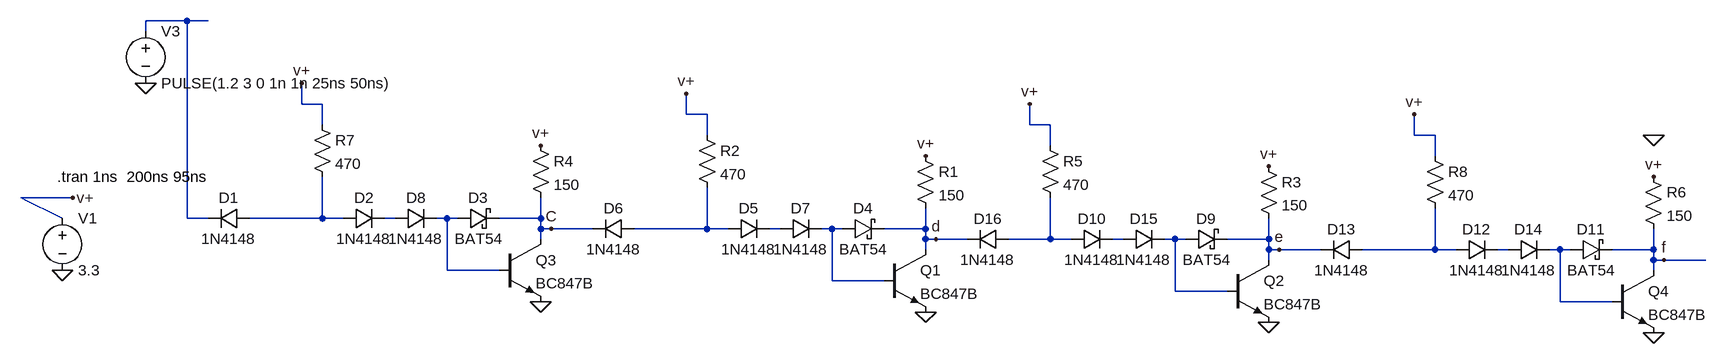
[diagram p0: schematic NandBakerClamp.asc]
NandBakerClamp.asc, the LTspice schematic file:
Version 4
SHEET 1 2532 952
WIRE -176 144 -240 144
WIRE -144 144 -176 144
WIRE -240 160 -240 144
WIRE 0 272 0 240
WIRE 32 272 0 272
WIRE 592 288 592 256
WIRE 624 288 592 288
WIRE 32 304 32 272
WIRE 1120 304 1120 272
WIRE 1152 304 1120 304
WIRE 624 320 624 288
WIRE 1712 320 1712 288
WIRE 1744 320 1712 320
WIRE 1152 336 1152 304
WIRE 1744 352 1744 320
WIRE -352 416 -432 416
WIRE -368 448 -432 416
WIRE -176 448 -176 144
WIRE -144 448 -176 448
WIRE 32 448 32 384
WIRE 32 448 -80 448
WIRE 64 448 32 448
WIRE 144 448 128 448
WIRE 224 448 208 448
WIRE 240 448 224 448
WIRE 368 448 368 416
WIRE 368 448 304 448
WIRE 368 464 368 448
WIRE 384 464 368 464
WIRE 448 464 384 464
WIRE 624 464 624 400
WIRE 624 464 512 464
WIRE 656 464 624 464
WIRE 736 464 720 464
WIRE 816 464 800 464
WIRE 832 464 816 464
WIRE 960 464 960 432
WIRE 960 464 896 464
WIRE 368 480 368 464
WIRE 960 480 960 464
WIRE 976 480 960 480
WIRE 1024 480 976 480
WIRE 1152 480 1152 416
WIRE 1152 480 1088 480
WIRE 1184 480 1152 480
WIRE 1264 480 1248 480
WIRE 1344 480 1328 480
WIRE 1360 480 1344 480
WIRE 1488 480 1488 448
WIRE 1488 480 1424 480
WIRE 960 496 960 480
WIRE 1488 496 1488 480
WIRE 1504 496 1488 496
WIRE 1568 496 1504 496
WIRE 1744 496 1744 432
WIRE 1744 496 1632 496
WIRE 1776 496 1744 496
WIRE 1856 496 1840 496
WIRE 1936 496 1920 496
WIRE 1952 496 1936 496
WIRE 2080 496 2080 464
WIRE 2080 496 2016 496
WIRE 1488 512 1488 496
WIRE 2080 512 2080 496
WIRE 2096 512 2080 512
WIRE 2160 512 2096 512
WIRE 224 528 224 448
WIRE 304 528 224 528
WIRE 2080 528 2080 512
WIRE 816 544 816 464
WIRE 896 544 816 544
WIRE 1344 560 1344 480
WIRE 1424 560 1344 560
WIRE 1936 576 1936 496
WIRE 2016 576 1936 576
FLAG -368 528 0
FLAG -352 416 v+
FLAG 368 576 0
FLAG 368 336 v+
FLAG 384 464 C
FLAG 0 240 v+
FLAG 960 592 0
FLAG 960 352 v+
FLAG 976 480 d
FLAG 592 256 v+
FLAG 1488 608 0
FLAG 1488 368 v+
FLAG 1504 496 e
FLAG 1120 272 v+
FLAG 2080 624 0
FLAG 2080 384 v+
FLAG 2096 512 f
FLAG 1712 288 v+
FLAG -240 240 0
FLAG 2080 320 0
SYMBOL voltage -368 432 R0
SYMATTR InstName V1
SYMATTR Value 3.3
SYMBOL npn 304 480 R0
SYMATTR InstName Q3
SYMATTR Value BC847B
SYMBOL res 352 320 R0
SYMATTR InstName R4
SYMATTR Value 150
SYMBOL res 16 288 R0
SYMATTR InstName R7
SYMATTR Value 470
SYMBOL schottky 240 464 R270
WINDOW 0 32 32 VTop 2
WINDOW 3 0 32 VBottom 2
SYMATTR InstName D3
SYMATTR Value BAT54
SYMATTR Description Diode
SYMATTR Type diode
SYMBOL diode -80 432 R90
WINDOW 0 0 32 VBottom 2
WINDOW 3 32 32 VTop 2
SYMATTR InstName D1
SYMATTR Value 1N4148
SYMBOL diode 64 432 M90
WINDOW 0 0 32 VBottom 2
WINDOW 3 32 32 VTop 2
SYMATTR InstName D2
SYMATTR Value 1N4148
SYMBOL npn 896 496 R0
SYMATTR InstName Q1
SYMATTR Value BC847B
SYMBOL res 944 336 R0
SYMATTR InstName R1
SYMATTR Value 150
SYMBOL res 608 304 R0
SYMATTR InstName R2
SYMATTR Value 470
SYMBOL schottky 832 480 R270
WINDOW 0 32 32 VTop 2
WINDOW 3 0 32 VBottom 2
SYMATTR InstName D4
SYMATTR Value BAT54
SYMATTR Description Diode
SYMATTR Type diode
SYMBOL diode 656 448 M90
WINDOW 0 0 32 VBottom 2
WINDOW 3 32 32 VTop 2
SYMATTR InstName D5
SYMATTR Value 1N4148
SYMBOL diode 512 480 M270
WINDOW 0 32 32 VTop 2
WINDOW 3 0 32 VBottom 2
SYMATTR InstName D6
SYMATTR Value 1N4148
SYMBOL diode 736 448 M90
WINDOW 0 0 32 VBottom 2
WINDOW 3 32 32 VTop 2
SYMATTR InstName D7
SYMATTR Value 1N4148
SYMBOL diode 144 432 M90
WINDOW 0 0 32 VBottom 2
WINDOW 3 32 32 VTop 2
SYMATTR InstName D8
SYMATTR Value 1N4148
SYMBOL npn 1424 512 R0
SYMATTR InstName Q2
SYMATTR Value BC847B
SYMBOL res 1472 352 R0
SYMATTR InstName R3
SYMATTR Value 150
SYMBOL res 1136 320 R0
SYMATTR InstName R5
SYMATTR Value 470
SYMBOL schottky 1360 496 R270
WINDOW 0 32 32 VTop 2
WINDOW 3 0 32 VBottom 2
SYMATTR InstName D9
SYMATTR Value BAT54
SYMATTR Description Diode
SYMATTR Type diode
SYMBOL diode 1184 464 M90
WINDOW 0 0 32 VBottom 2
WINDOW 3 32 32 VTop 2
SYMATTR InstName D10
SYMATTR Value 1N4148
SYMBOL npn 2016 528 R0
SYMATTR InstName Q4
SYMATTR Value BC847B
SYMBOL res 2064 368 R0
SYMATTR InstName R6
SYMATTR Value 150
SYMBOL res 1728 336 R0
SYMATTR InstName R8
SYMATTR Value 470
SYMBOL schottky 1952 512 R270
WINDOW 0 32 32 VTop 2
WINDOW 3 0 32 VBottom 2
SYMATTR InstName D11
SYMATTR Value BAT54
SYMATTR Description Diode
SYMATTR Type diode
SYMBOL diode 1776 480 M90
WINDOW 0 0 32 VBottom 2
WINDOW 3 32 32 VTop 2
SYMATTR InstName D12
SYMATTR Value 1N4148
SYMBOL diode 1632 512 M270
WINDOW 0 32 32 VTop 2
WINDOW 3 0 32 VBottom 2
SYMATTR InstName D13
SYMATTR Value 1N4148
SYMBOL diode 1856 480 M90
WINDOW 0 0 32 VBottom 2
WINDOW 3 32 32 VTop 2
SYMATTR InstName D14
SYMATTR Value 1N4148
SYMBOL diode 1264 464 M90
WINDOW 0 0 32 VBottom 2
WINDOW 3 32 32 VTop 2
SYMATTR InstName D15
SYMATTR Value 1N4148
SYMBOL voltage -240 144 R0
SYMATTR InstName V3
SYMATTR Value PULSE(1.2 3 0 1n 1n 25ns 50ns)
SYMBOL diode 1088 496 M270
WINDOW 0 32 32 VTop 2
WINDOW 3 0 32 VBottom 2
SYMATTR InstName D16
SYMATTR Value 1N4148
TEXT -376 384 Left 2 !.tran 1ns  200ns 95ns

The netlist it stands for:
* NandBakerClamp.asc
V1 v+ 0 3.3
Q3 C N004 0 0 BC847B
R4 v+ C 150
R7 v+ N002 470
D3 N004 C BAT54
D1 N002 N001 1N4148
D2 N002 N003 1N4148
Q1 d N007 0 0 BC847B
R1 v+ d 150
R2 v+ N005 470
D4 N007 d BAT54
D5 N005 N006 1N4148
D6 N005 C 1N4148
D7 N006 N007 1N4148
D8 N003 N004 1N4148
Q2 e N010 0 0 BC847B
R3 v+ e 150
R5 v+ N008 470
D9 N010 e BAT54
D10 N008 N009 1N4148
Q4 f N013 0 0 BC847B
R6 v+ f 150
R8 v+ N011 470
D11 N013 f BAT54
D12 N011 N012 1N4148
D13 N011 e 1N4148
D14 N012 N013 1N4148
D15 N009 N010 1N4148
V3 N001 0 PULSE(1.2 3 0 1n 1n 25ns 50ns)
D16 N008 d 1N4148
.model D D
.lib standard.dio
.model NPN NPN
.model PNP PNP
.lib standard.bjt
.tran 1ns  200ns 95ns
.backanno
.end